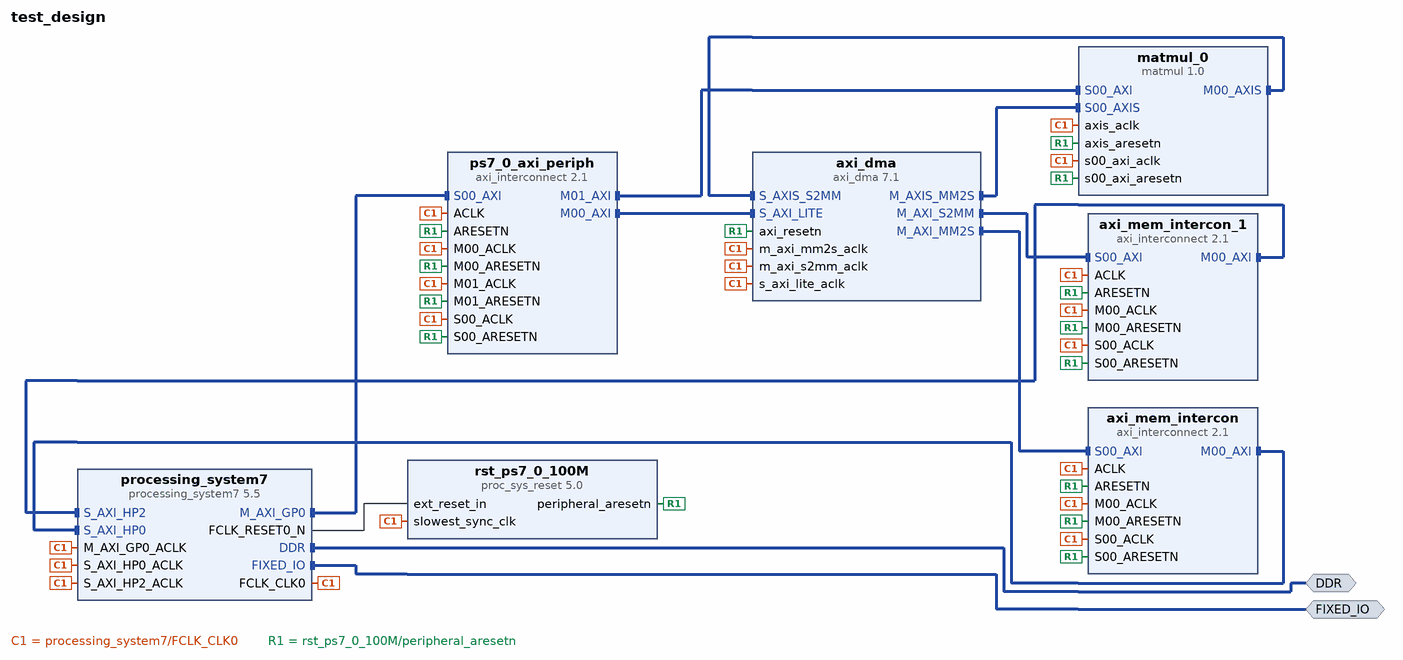
[diagram p0: block diagram of the top level]
# Vivado block design test_design, xc7z020clg400-1, Vivado 2023.2
create_bd_design test_design

create_bd_intf_port -mode Master -vlnv xilinx.com:interface:ddrx_rtl:1.0 DDR
create_bd_intf_port -mode Master -vlnv xilinx.com:display_processing_system7:fixedio_rtl:1.0 FIXED_IO

create_bd_cell -type ip -vlnv xilinx.com:ip:axi_dma:7.1 axi_dma
set_property -dict [list \
  CONFIG.c_include_sg 0 \
  CONFIG.c_m_axi_mm2s_data_width 64 \
  CONFIG.c_m_axis_mm2s_tdata_width 8 \
  CONFIG.c_mm2s_burst_size 64 \
  CONFIG.c_s2mm_burst_size 16 \
  CONFIG.c_sg_length_width 26 \
] [get_bd_cells axi_dma]
create_bd_cell -type ip -vlnv xilinx.com:ip:processing_system7:5.5 processing_system7
set_property -dict [list \
  CONFIG.PCW_APU_PERIPHERAL_FREQMHZ 650 \
  CONFIG.PCW_CRYSTAL_PERIPHERAL_FREQMHZ 50 \
  CONFIG.PCW_ENET0_ENET0_IO {MIO 16 .. 27} \
  CONFIG.PCW_ENET0_GRP_MDIO_ENABLE 1 \
  CONFIG.PCW_ENET0_GRP_MDIO_IO {MIO 52 .. 53} \
  CONFIG.PCW_ENET0_PERIPHERAL_ENABLE 1 \
  CONFIG.PCW_ENET0_RESET_ENABLE 1 \
  CONFIG.PCW_ENET0_RESET_IO {MIO 9} \
  CONFIG.PCW_ENET_RESET_ENABLE 1 \
  CONFIG.PCW_ENET_RESET_SELECT {Share reset pin} \
  CONFIG.PCW_FPGA0_PERIPHERAL_FREQMHZ 100 \
  CONFIG.PCW_FPGA1_PERIPHERAL_FREQMHZ 50 \
  CONFIG.PCW_GPIO_MIO_GPIO_ENABLE 1 \
  CONFIG.PCW_GPIO_MIO_GPIO_IO MIO \
  CONFIG.PCW_I2C_RESET_ENABLE 1 \
  CONFIG.PCW_M_AXI_GP0_FREQMHZ 10 \
  CONFIG.PCW_PERIPHERAL_BOARD_PRESET None \
  CONFIG.PCW_PRESET_BANK1_VOLTAGE {LVCMOS 1.8V} \
  CONFIG.PCW_QSPI_GRP_FBCLK_ENABLE 1 \
  CONFIG.PCW_QSPI_GRP_FBCLK_IO {MIO 8} \
  CONFIG.PCW_QSPI_GRP_SINGLE_SS_ENABLE 1 \
  CONFIG.PCW_QSPI_GRP_SINGLE_SS_IO {MIO 1 .. 6} \
  CONFIG.PCW_QSPI_PERIPHERAL_ENABLE 1 \
  CONFIG.PCW_QSPI_QSPI_IO {MIO 1 .. 6} \
  CONFIG.PCW_SD0_GRP_CD_ENABLE 1 \
  CONFIG.PCW_SD0_GRP_CD_IO {MIO 47} \
  CONFIG.PCW_SD0_GRP_WP_ENABLE 0 \
  CONFIG.PCW_SD0_PERIPHERAL_ENABLE 1 \
  CONFIG.PCW_SD0_SD0_IO {MIO 40 .. 45} \
  CONFIG.PCW_SDIO_PERIPHERAL_FREQMHZ 50 \
  CONFIG.PCW_SINGLE_QSPI_DATA_MODE x4 \
  CONFIG.PCW_S_AXI_HP0_FREQMHZ 10 \
  CONFIG.PCW_UART0_PERIPHERAL_ENABLE 1 \
  CONFIG.PCW_UART0_UART0_IO {MIO 14 .. 15} \
  CONFIG.PCW_UART1_PERIPHERAL_ENABLE 0 \
  CONFIG.PCW_UART_PERIPHERAL_FREQMHZ 100 \
  CONFIG.PCW_UIPARAM_DDR_BUS_WIDTH {16 Bit} \
  CONFIG.PCW_UIPARAM_DDR_FREQ_MHZ 525 \
  CONFIG.PCW_UIPARAM_DDR_PARTNO {MT41J256M16 RE-125} \
  CONFIG.PCW_USB0_PERIPHERAL_ENABLE 1 \
  CONFIG.PCW_USB0_RESET_ENABLE 1 \
  CONFIG.PCW_USB0_RESET_IO {MIO 46} \
  CONFIG.PCW_USB0_USB0_IO {MIO 28 .. 39} \
  CONFIG.PCW_USB_RESET_ENABLE 1 \
  CONFIG.PCW_USB_RESET_SELECT {Share reset pin} \
  CONFIG.PCW_USE_S_AXI_HP0 1 \
  CONFIG.PCW_USE_S_AXI_HP2 1 \
] [get_bd_cells processing_system7]
# 484 more settings of processing_system7 are not shown: defaults, MIO pin electricals, DDR timing, and values the tool derives
create_bd_cell -type ip -vlnv xilinx.com:ip:axi_interconnect:2.1 ps7_0_axi_periph
set_property -dict {CONFIG.NUM_MI 2} [get_bd_cells ps7_0_axi_periph]
create_bd_cell -type ip -vlnv xilinx.com:ip:proc_sys_reset:5.0 rst_ps7_0_100M
create_bd_cell -type ip -vlnv xilinx.com:ip:axi_interconnect:2.1 axi_mem_intercon
set_property -dict {CONFIG.NUM_MI 1} [get_bd_cells axi_mem_intercon]
create_bd_cell -type ip -vlnv xilinx.com:ip:axi_interconnect:2.1 axi_mem_intercon_1
set_property -dict {CONFIG.NUM_MI 1} [get_bd_cells axi_mem_intercon_1]
create_bd_cell -type ip -vlnv xilinx.com:user:matmul:1.0 matmul_0

# ---- connections ----

connect_bd_intf_net [get_bd_intf_pins axi_dma/M_AXIS_MM2S] [get_bd_intf_pins matmul_0/S00_AXIS]
connect_bd_intf_net [get_bd_intf_pins axi_dma/M_AXI_MM2S] [get_bd_intf_pins axi_mem_intercon/S00_AXI]
connect_bd_intf_net [get_bd_intf_pins axi_dma/M_AXI_S2MM] [get_bd_intf_pins axi_mem_intercon_1/S00_AXI]
connect_bd_intf_net [get_bd_intf_pins axi_mem_intercon_1/M00_AXI] [get_bd_intf_pins processing_system7/S_AXI_HP2]
connect_bd_intf_net [get_bd_intf_pins axi_mem_intercon/M00_AXI] [get_bd_intf_pins processing_system7/S_AXI_HP0]
connect_bd_intf_net [get_bd_intf_pins matmul_0/M00_AXIS] [get_bd_intf_pins axi_dma/S_AXIS_S2MM]
connect_bd_intf_net -intf_net processing_system7_0_DDR [get_bd_intf_ports DDR] [get_bd_intf_pins processing_system7/DDR]
connect_bd_intf_net -intf_net processing_system7_0_FIXED_IO [get_bd_intf_ports FIXED_IO] [get_bd_intf_pins processing_system7/FIXED_IO]
connect_bd_intf_net -intf_net processing_system7_0_M_AXI_GP0 [get_bd_intf_pins processing_system7/M_AXI_GP0] [get_bd_intf_pins ps7_0_axi_periph/S00_AXI]
connect_bd_intf_net [get_bd_intf_pins ps7_0_axi_periph/M00_AXI] [get_bd_intf_pins axi_dma/S_AXI_LITE]
connect_bd_intf_net [get_bd_intf_pins ps7_0_axi_periph/M01_AXI] [get_bd_intf_pins matmul_0/S00_AXI]
connect_bd_net -net processing_system7_0_FCLK_CLK0 [get_bd_pins processing_system7/FCLK_CLK0] \
  [get_bd_pins processing_system7/M_AXI_GP0_ACLK] [get_bd_pins ps7_0_axi_periph/S00_ACLK] \
  [get_bd_pins rst_ps7_0_100M/slowest_sync_clk] [get_bd_pins axi_dma/s_axi_lite_aclk] [get_bd_pins ps7_0_axi_periph/M00_ACLK] \
  [get_bd_pins ps7_0_axi_periph/ACLK] [get_bd_pins axi_dma/m_axi_mm2s_aclk] [get_bd_pins axi_mem_intercon/S00_ACLK] \
  [get_bd_pins processing_system7/S_AXI_HP0_ACLK] [get_bd_pins axi_mem_intercon/M00_ACLK] [get_bd_pins axi_mem_intercon/ACLK] \
  [get_bd_pins axi_dma/m_axi_s2mm_aclk] [get_bd_pins axi_mem_intercon_1/S00_ACLK] \
  [get_bd_pins processing_system7/S_AXI_HP2_ACLK] [get_bd_pins axi_mem_intercon_1/M00_ACLK] \
  [get_bd_pins axi_mem_intercon_1/ACLK] [get_bd_pins ps7_0_axi_periph/M01_ACLK] [get_bd_pins matmul_0/s00_axi_aclk] \
  [get_bd_pins matmul_0/axis_aclk]
connect_bd_net -net processing_system7_0_FCLK_RESET0_N [get_bd_pins processing_system7/FCLK_RESET0_N] [get_bd_pins rst_ps7_0_100M/ext_reset_in]
connect_bd_net [get_bd_pins rst_ps7_0_100M/peripheral_aresetn] \
  [get_bd_pins ps7_0_axi_periph/S00_ARESETN] [get_bd_pins axi_dma/axi_resetn] [get_bd_pins ps7_0_axi_periph/M00_ARESETN] \
  [get_bd_pins ps7_0_axi_periph/ARESETN] [get_bd_pins axi_mem_intercon/S00_ARESETN] \
  [get_bd_pins axi_mem_intercon/M00_ARESETN] [get_bd_pins axi_mem_intercon/ARESETN] \
  [get_bd_pins axi_mem_intercon_1/S00_ARESETN] [get_bd_pins axi_mem_intercon_1/M00_ARESETN] \
  [get_bd_pins axi_mem_intercon_1/ARESETN] [get_bd_pins ps7_0_axi_periph/M01_ARESETN] [get_bd_pins matmul_0/s00_axi_aresetn] \
  [get_bd_pins matmul_0/axis_aresetn]

# ---- address map ----
assign_bd_address -offset 0x00000000 -range 512M -target_address_space [get_bd_addr_spaces axi_dma/Data_MM2S] [get_bd_addr_segs processing_system7/S_AXI_HP0/HP0_DDR_LOWOCM]
assign_bd_address -offset 0x00000000 -range 512M -target_address_space [get_bd_addr_spaces axi_dma/Data_S2MM] [get_bd_addr_segs processing_system7/S_AXI_HP2/HP2_DDR_LOWOCM]
assign_bd_address -offset 0x40400000 -range 64K -target_address_space [get_bd_addr_spaces processing_system7/Data] [get_bd_addr_segs axi_dma/S_AXI_LITE/Reg]
assign_bd_address -offset 0x43C00000 -range 64K -target_address_space [get_bd_addr_spaces processing_system7/Data] [get_bd_addr_segs matmul_0/S00_AXI/S00_AXI_reg]

validate_bd_design
save_bd_design
